# EAGLE design stepper-hbridge-xiao (EAGLE 9.7.0)
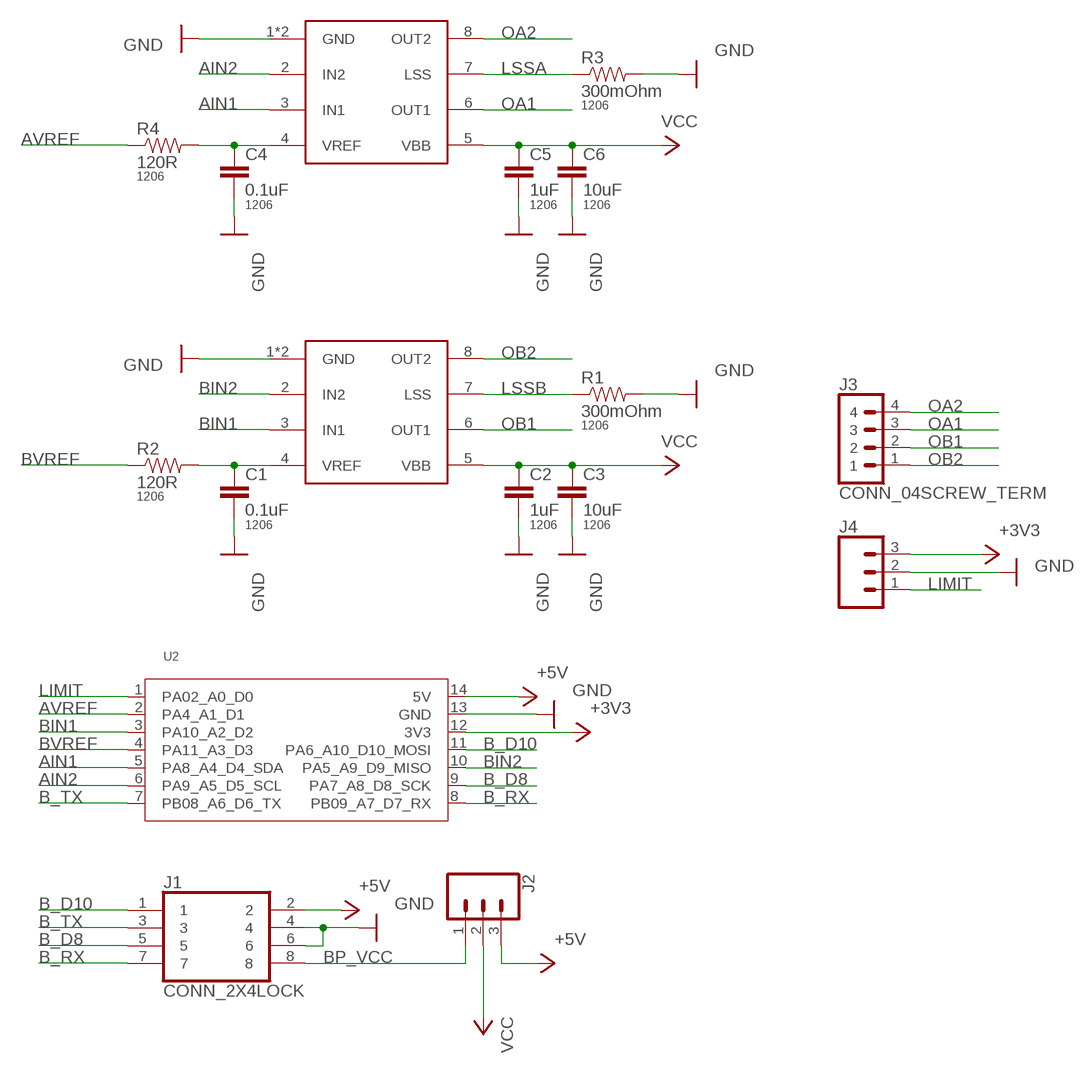
[diagram p0: schematic, sheet 1]

## Parts
C1  0.1uF  CAP1206  [1206]
C2  1uF  CAP1206  [1206]
C3  10uF  CAP1206  [1206]
C4  0.1uF  CAP1206  [1206]
C5  1uF  CAP1206  [1206]
C6  10uF  CAP1206  [1206]
J1  CONN_2X4LOCK  [2X4-LOCK]
J2  CONN_03LOCK_NO_SILK  [1X03_LOCK_NO_SILK]
J3  CONN_04SCREW_TERM  [1X04_SCREW-TERM]
J4  CONN_03LOCK_NO_SILK  [1X03_LOCK_NO_SILK]
R1  300mOhm  RESISTOR1206  [1206]
R2  120R  RESISTOR1206  [1206]
R3  300mOhm  RESISTOR1206  [1206]
R4  120R  RESISTOR1206  [1206]
U1  A4950  [SOIC8_PAD]
U2  MOUDLE-SEEEDUINO-XIAO-DIP  [MOUDLE14P-2.54-21X17.8MM]
U3  A4950  [SOIC8_PAD]

## Nets
+3V3: J4.3 U2.12(3V3)
+5V: J1.2 J2.3 U2.14(5V)
AIN1: U2.5(PA8_A4_D4_SDA) U3.3(IN1)
AIN2: U2.6(PA9_A5_D5_SCL) U3.2(IN2)
AVREF: R4.1 U2.2(PA4_A1_D1)
B_D8: J1.5 U2.9(PA7_A8_D8_SCK)
B_D10: J1.1 U2.11(PA6_A10_D10_MOSI)
B_RX: J1.7 U2.8(PB09_A7_D7_RX)
B_TX: J1.3 U2.7(PB08_A6_D6_TX)
BIN1: U1.3(IN1) U2.3(PA10_A2_D2)
BIN2: U1.2(IN2) U2.10(PA5_A9_D9_MISO)
BP_VCC: J1.8 J2.1
BVREF: R2.1 U2.4(PA11_A3_D3)
GND: C1.2 C2.2 C3.2 C4.2 C5.2 C6.2 J1.4 J1.6 J4.2 R1.2 R3.2 U1.1(GND) U1.P$1(GND) U2.13(GND) U3.1(GND) U3.P$1(GND)
LIMIT: J4.1 U2.1(PA02_A0_D0)
LSSA: R3.1 U3.7(LSS)
LSSB: R1.1 U1.7(LSS)
N$1: C1.1 R2.2 U1.4(VREF)
N$2: C4.1 R4.2 U3.4(VREF)
OA1: J3.3 U3.6(OUT1)
OA2: J3.4 U3.8(OUT2)
OB1: J3.2 U1.6(OUT1)
OB2: J3.1 U1.8(OUT2)
VCC: C2.1 C3.1 C5.1 C6.1 J2.2 U1.5(VBB) U3.5(VBB)

## Library data of the parts
C1-C6 = jrr_passives:CAP: Capacitor Standard 0603 ceramic capacitor, and 0.1" leaded capacitor.; PACKAGE: 1206
J1 = jrr_connector:CONN_2X4
J2 J4 = jrr_connector:CONN_03: Multi connection point. Often used as Generic Header-pin footprint for 0.1 inch spaced/style header connections On any of the 0.1 inch spaced packages, you can populate with these: Break Away Headers - Straight <https://www.sparkfun.com/products/116> (PRT-00116) Break Away Male Headers - Right Angle <https://www.sparkfun.com/products/553> (PRT-00553) Female Headers <https://www.sparkfun.com/products/115> (PRT-00115) Break Away Headers - Machine Pin <https://www.sparkfun.com/products/117> (PRT-00117) Break Away Female Headers - Swiss Machine Pin <https://www.sparkfun.com/products/743> (PRT-00743) Stackable Header - 3 Pin (Female, 0.1") <https://www.sparkfun.com/products/13875> (PRT-13875) For SCREWTERMINALS and SPRING TERMINALS visit here: Screw Terimnals on SparkFun.com <https://www.sparkfun.com/search/results?term=Screw+Terminals> (5mm/3.5mm/2.54mm spacing) This device is also useful as a general connection point to wire up your design to another part of your project. Our various solder wires solder well into these plated through hole pads. Hook-Up Wire - Assortment (Stranded, 22 AWG) <https://www.sparkfun.com/products/11375> (PRT-11375) Hook-Up Wire - Assortment (Solid Core, 22 AWG) <https://www.sparkfun.com/products/11367> (PRT-11367) View the entire wire category on our website here <https://www.sparkfun.com/categories/141> Special notes: Molex polarized connector foot print use with SKU : PRT-08232 with associated crimp pins and housings.
J3 = jrr_connector:CONN_04
R1-R4 = jrr_passives:RESISTOR: Resistor Basic schematic elements and footprints for 0603, 1206, and PTH resistors.; PACKAGE: 1206
U1 U3 = jrr_power:A4950
U2 = xiao:MOUDLE-SEEEDUINO-XIAO

## Board
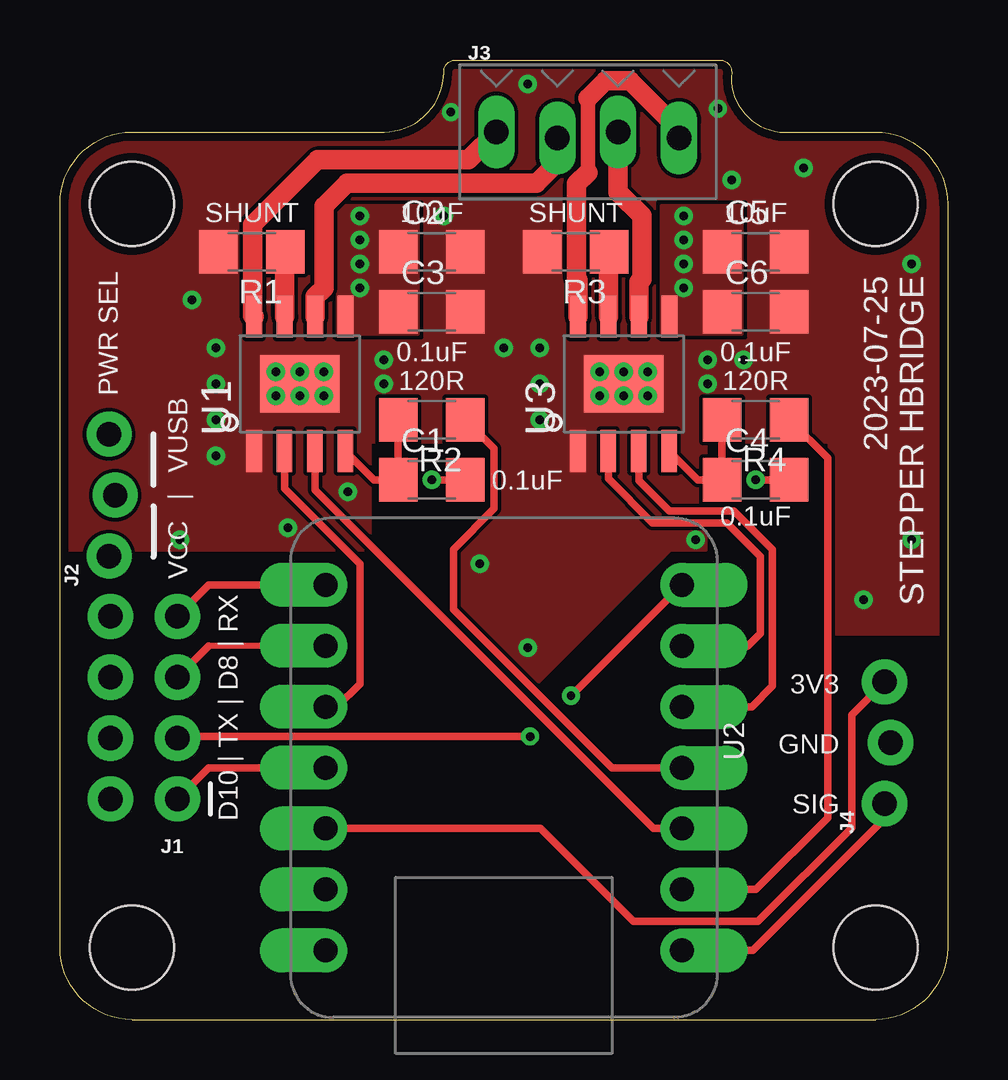
[diagram p1: board, top side]
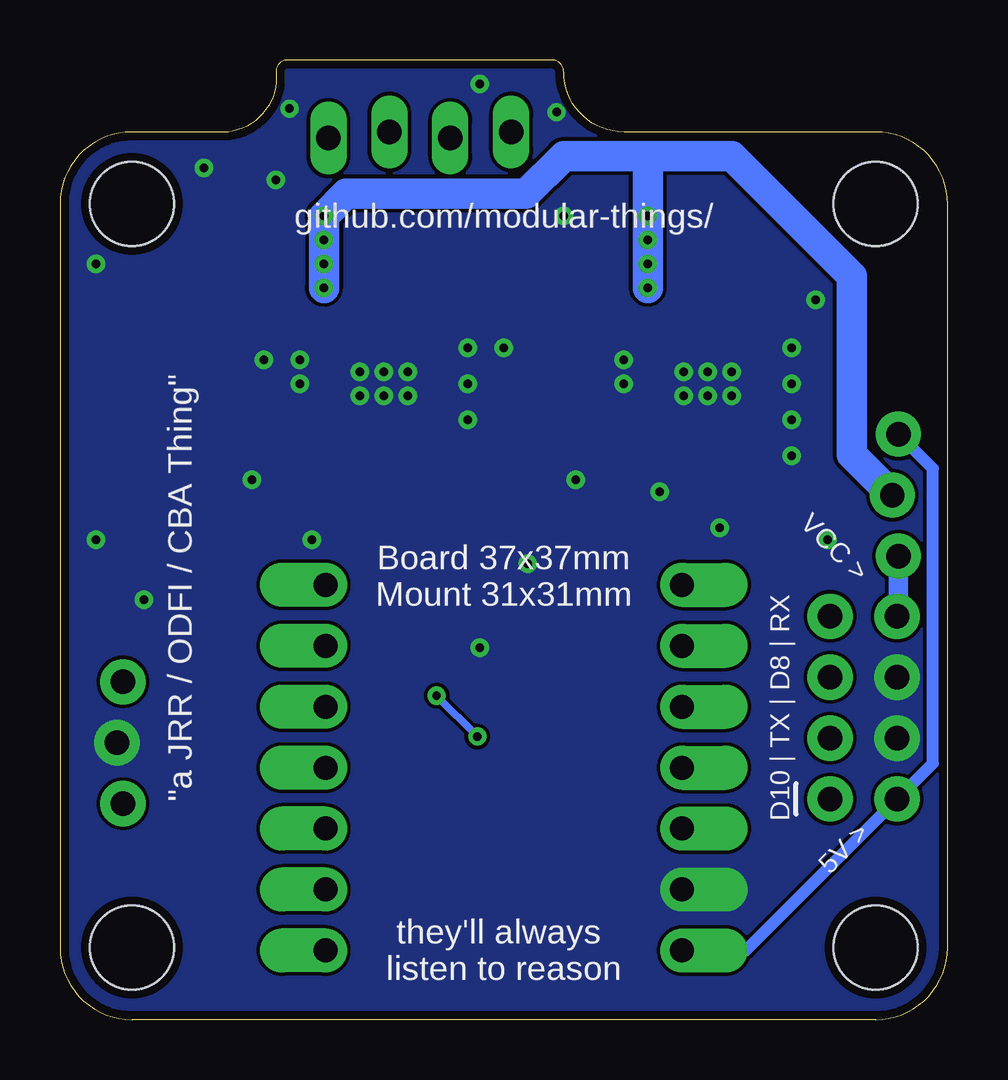
[diagram p2: board, bottom side, seen from below]

Size 37 x 40 mm. Coordinates in mm from the lower left corner, seen from the top.
Outline: 0,3 0,34 arc-90 3,37 13.5,37 arc90 16,39.5 arc-90 16.5,40 27.5,40 arc-90 28,39.5 arc90 30,37 34,37 arc-90 37,34 37,3 arc-90 34,0 3,0 arc-90 0,3
Copper layers (1*16): Top 0.035mm / dielectric 1.5mm / Bottom 0.035mm
Design rules "default *": minimum track width 8mil, minimum drill 0.25mm, track to track 6mil, track to pad 6mil, pad to pad 6mil, via to via 6mil, smd to smd 0mil, copper to edge 14mil, drill to drill 17mil, minimum pad ring 10mil, minimum via ring 8mil, stop-mask expansion 4mil, vias tented up to drill 60mil, thermal gap 8mil
Holes 3.5 mm at 34,3 3,3 3,34 34,34

### Footprints (pad centres in the part's own frame; a part is rotated, then mirrored left to right if it is on the bottom)
1206 = smd 1.6 x 1.8: 1 -1.4,0; 2 1.4,0
2X4-LOCK = drill 1.016 pad 1.88: 1 -1.397,3.81; 2 1.397,3.81; 3 -1.397,1.27; 4 1.397,1.27; 5 -1.397,-1.27; 6 1.397,-1.27; 7 -1.397,-3.81; 8 1.397,-3.81
1X03_LOCK_NO_SILK = drill 1.016 pad 1.88: 1 0,0.127; 2 2.54,-0.127; 3 5.08,0.127
1X04_SCREW-TERM = drill 1.016 long: 1 -3.81,0; 2 -1.27,-0.254; 3 1.27,0; 4 3.81,-0.254
SOIC8_PAD = smd 1.75 x 0.65: 1 -2.8,1.905; 2 -2.8,0.645; 3 -2.8,-0.625; 4 -2.8,-1.895; 5 2.8,-1.905; 6 2.8,-0.635; 7 2.8,0.635; 8 2.8,1.905 | smd 2.41 x 3.3: P$1 0,0
MOUDLE14P-2.54-21X17.8MM = drill 1 pad 1.829 offset: 1 7.62,7.429; 2 5.08,7.429; 3 2.54,7.429; 4 0,7.429; 5 -2.54,7.429; 6 -5.08,7.429; 7 -7.62,7.429; 8 -7.62,-7.429; 9 -5.08,-7.429; 10 -2.54,-7.429; 11 0,-7.429; 12 2.54,-7.429; 13 5.08,-7.429; 14 7.62,-7.429

### Placement (x,y rotation side)
C1  15.5,22.5 0 top
C2  15.5,32 0 top
C3  15.5,29.5 0 top
C4  29,22.5 0 top
C5  29,32 0 top
C6  29,29.5 0 top
J1  3.5,13 180 top
J2  2.17,19.32 90 top
J3  22,37 0 top
J4  34.5,9 90 top
R1  8,32 180 top
R2  15.5,25 180 top
R3  21.5,32 180 top
R4  29,25 180 top
U1  10,26.5 90 top
U2  18.5,10.5 270 top
U3  23.5,26.5 90 top

### Tracks (layer width: path | path; a pad name or v marks a point on that pad's centre or on a via)
+3V3
  Top 0.305: U2.12 20.04,7.96 23.9,4.1 29.1,4.1 33,8 33,12.71 J4.3
+5V
  Bottom 0.508: U2.14 8.41,2.88 J1.2 0.61,10.68 0.61,22.96 J2.3
AIN1
  Top 0.305: U3.3 24.12,22.48 25.4,21.2 28.1,21.2 29.7,19.6 29.7,13.9 28.84,13.04 U2.5
AIN2
  Top 0.305: U2.6 28.68,15.58 29.2,16.1 29.2,19.3 27.8,20.7 24.7,20.7 22.86,22.55 U3.2
AVREF
  Top 0.305: R4.1 32,23.4 32,16.5 32,8.4 29.02,5.42 U2.2
B_D8
  Top 0.254: U2.9 6.21,15.58
  Top 0.305: J1.5 6.21,15.58
B_D10
  Top 0.305: U2.11 6.21,10.5 J1.1
B_RX
  Top 0.305: J1.7 6.21,18.12 U2.8
B_TX  (via drill 0.35)
  Top 0.254: 4.97,11.8 J1.3 | v21.31,13.5 v21.3,13.5
  Top 0.305: U2.7 v21.31,13.5 | v19.6,11.8 4.97,11.8
  Bottom 0.305: v21.3,13.5 v19.6,11.8
BIN1
  Top 0.305: U1.3 10.62,22.07 24.74,7.96 U2.3
BIN2
  Top 0.305: U2.10 11.54,13.04 12.5,14 12.5,19 9.36,22.14 U1.2
BP_VCC
  Bottom 0.508: 2.05,16.86 J1.8
  Bottom 0.813: J2.1 2.05,16.86
BVREF
  Top 0.305: U2.4 23,10.5 18.5,15 16.4,17.1 16.4,19.6 18.1,21.3 18.1,23.8 R2.1
GND  (via drill 0.35)
  Top 0.305: v15.5,22.5 C1.2 | C4.2 v29,22.5
  other vias: 5,20 9.5,20.5 12,22 17.5,19 26.5,20 35.5,20 35.5,31.5 31,35.5 9,27 11,27 10,27 9,26 10,26 11,26 22.5,27 23.5,27 24.5,27 24.5,26 23.5,26 22.5,26 20,28 20,25 20,26.5 27,26.5 13.5,26.5 6.5,28 6.5,26.5 6.5,25 16,33.5 28,35 18.5,28 19.5,15.5 33.5,17.5 27,27.5 13.5,27.5 5.5,30 19.5,39 27.43,37.97 16.3,37.83 6.5,23.5 28.5,27.5
  pour Bottom (rank 3, no thermals): -0.92,-0.92 37.92,-0.92 37.92,40.42 -0.92,40.42
  pour Top (rank 2, no thermals): 18.08,20.98 18.06,20.96 16.58,19.47 16.58,17.03 19.75,13.86 25.46,19.56 25.48,19.58 26.92,19.58 26.92,24.02 26.94,24.04 26.96,24.06 26.98,24.08 32.02,24.08 32.04,24.06 32.06,24.04 32.08,24.02 32.08,16.08 38.92,16.08 38.92,41.92 -1.92,41.92 -1.92,19.58 12.92,19.58 12.92,24.02 12.94,24.04 12.96,24.06 12.98,24.08 18.02,24.08 18.04,24.06 18.06,24.04 18.08,24.02
LIMIT
  Top 0.305: U2.1 28.88,2.88 34.37,8.37 J4.1
LSSA
  Top 0.813: U3.7 22.86,31.97 R3.1
LSSB
  Top 0.813: U1.7 9.37,31.97 R1.1
N$1
  Top 0.305: R2.2 C1.1 13.1,22.5 U1.4
N$2
  Top 0.305: U3.4 26.59,22.5 C4.1 R4.2
OA1
  Top 0.813: J3.3 23.27,34.5 24.26,33.51 24.26,30.87 24.14,30.75 U3.6
OA2
  Top 0.61: 22,35.3 22,38.4
  Top 0.813: U3.8 21.59,30.82 21.54,30.87 21.54,34.84 22,35.3 | 22,38.4 22.74,39.14 23.76,39.14 25.81,37.09 J3.4
OB1
  Top 0.813: U1.6 10.63,30.14 11,30.5 11,33.9 11.97,34.87 19.87,34.87 20.73,35.73 J3.2
OB2
  Top 0.813: U1.8 8.04,29.35 8.04,33.13 10.75,35.84 17.03,35.84 J3.1
VCC  (via drill 0.35)
  Bottom 1.27: J2.2 4,23.56 4,31 9,36 12.5,36 | 12.5,36 16,36 17.57,34.44 25.07,34.44 v26,33.5 v26,30.5 | v12.5,30.5 12.5,36
  other vias: 26,32.5 26,31.5 12.5,33.5 12.5,32.5 12.5,31.5
  pour Top (no thermals): 11.58,28.58 14.92,28.58 14.92,33.92 11.58,33.92
  pour Top (no thermals): 25.08,28.58 28.42,28.58 28.42,33.92 25.08,33.92

### Text on the board
tPlace: SHUNT | 10uF | SHUNT | 10uF | 2023-07-25 | STEPPER HBRIDGE | 0.1uF | 0.1uF | 120R | 120R | PWR SEL | VUSB | 0.1uF | | | VCC | 0.1uF | 3V3 | D10 | TX | D8 | RX | GND | SIG
bPlace: github.com/modular-things/ | VCC > | Board 37x37mm / Mount 31x31mm | "a JRR / ODFI / CBA Thing" | D10 | TX | D8 | RX | 5V > | they'll always / listen to reason